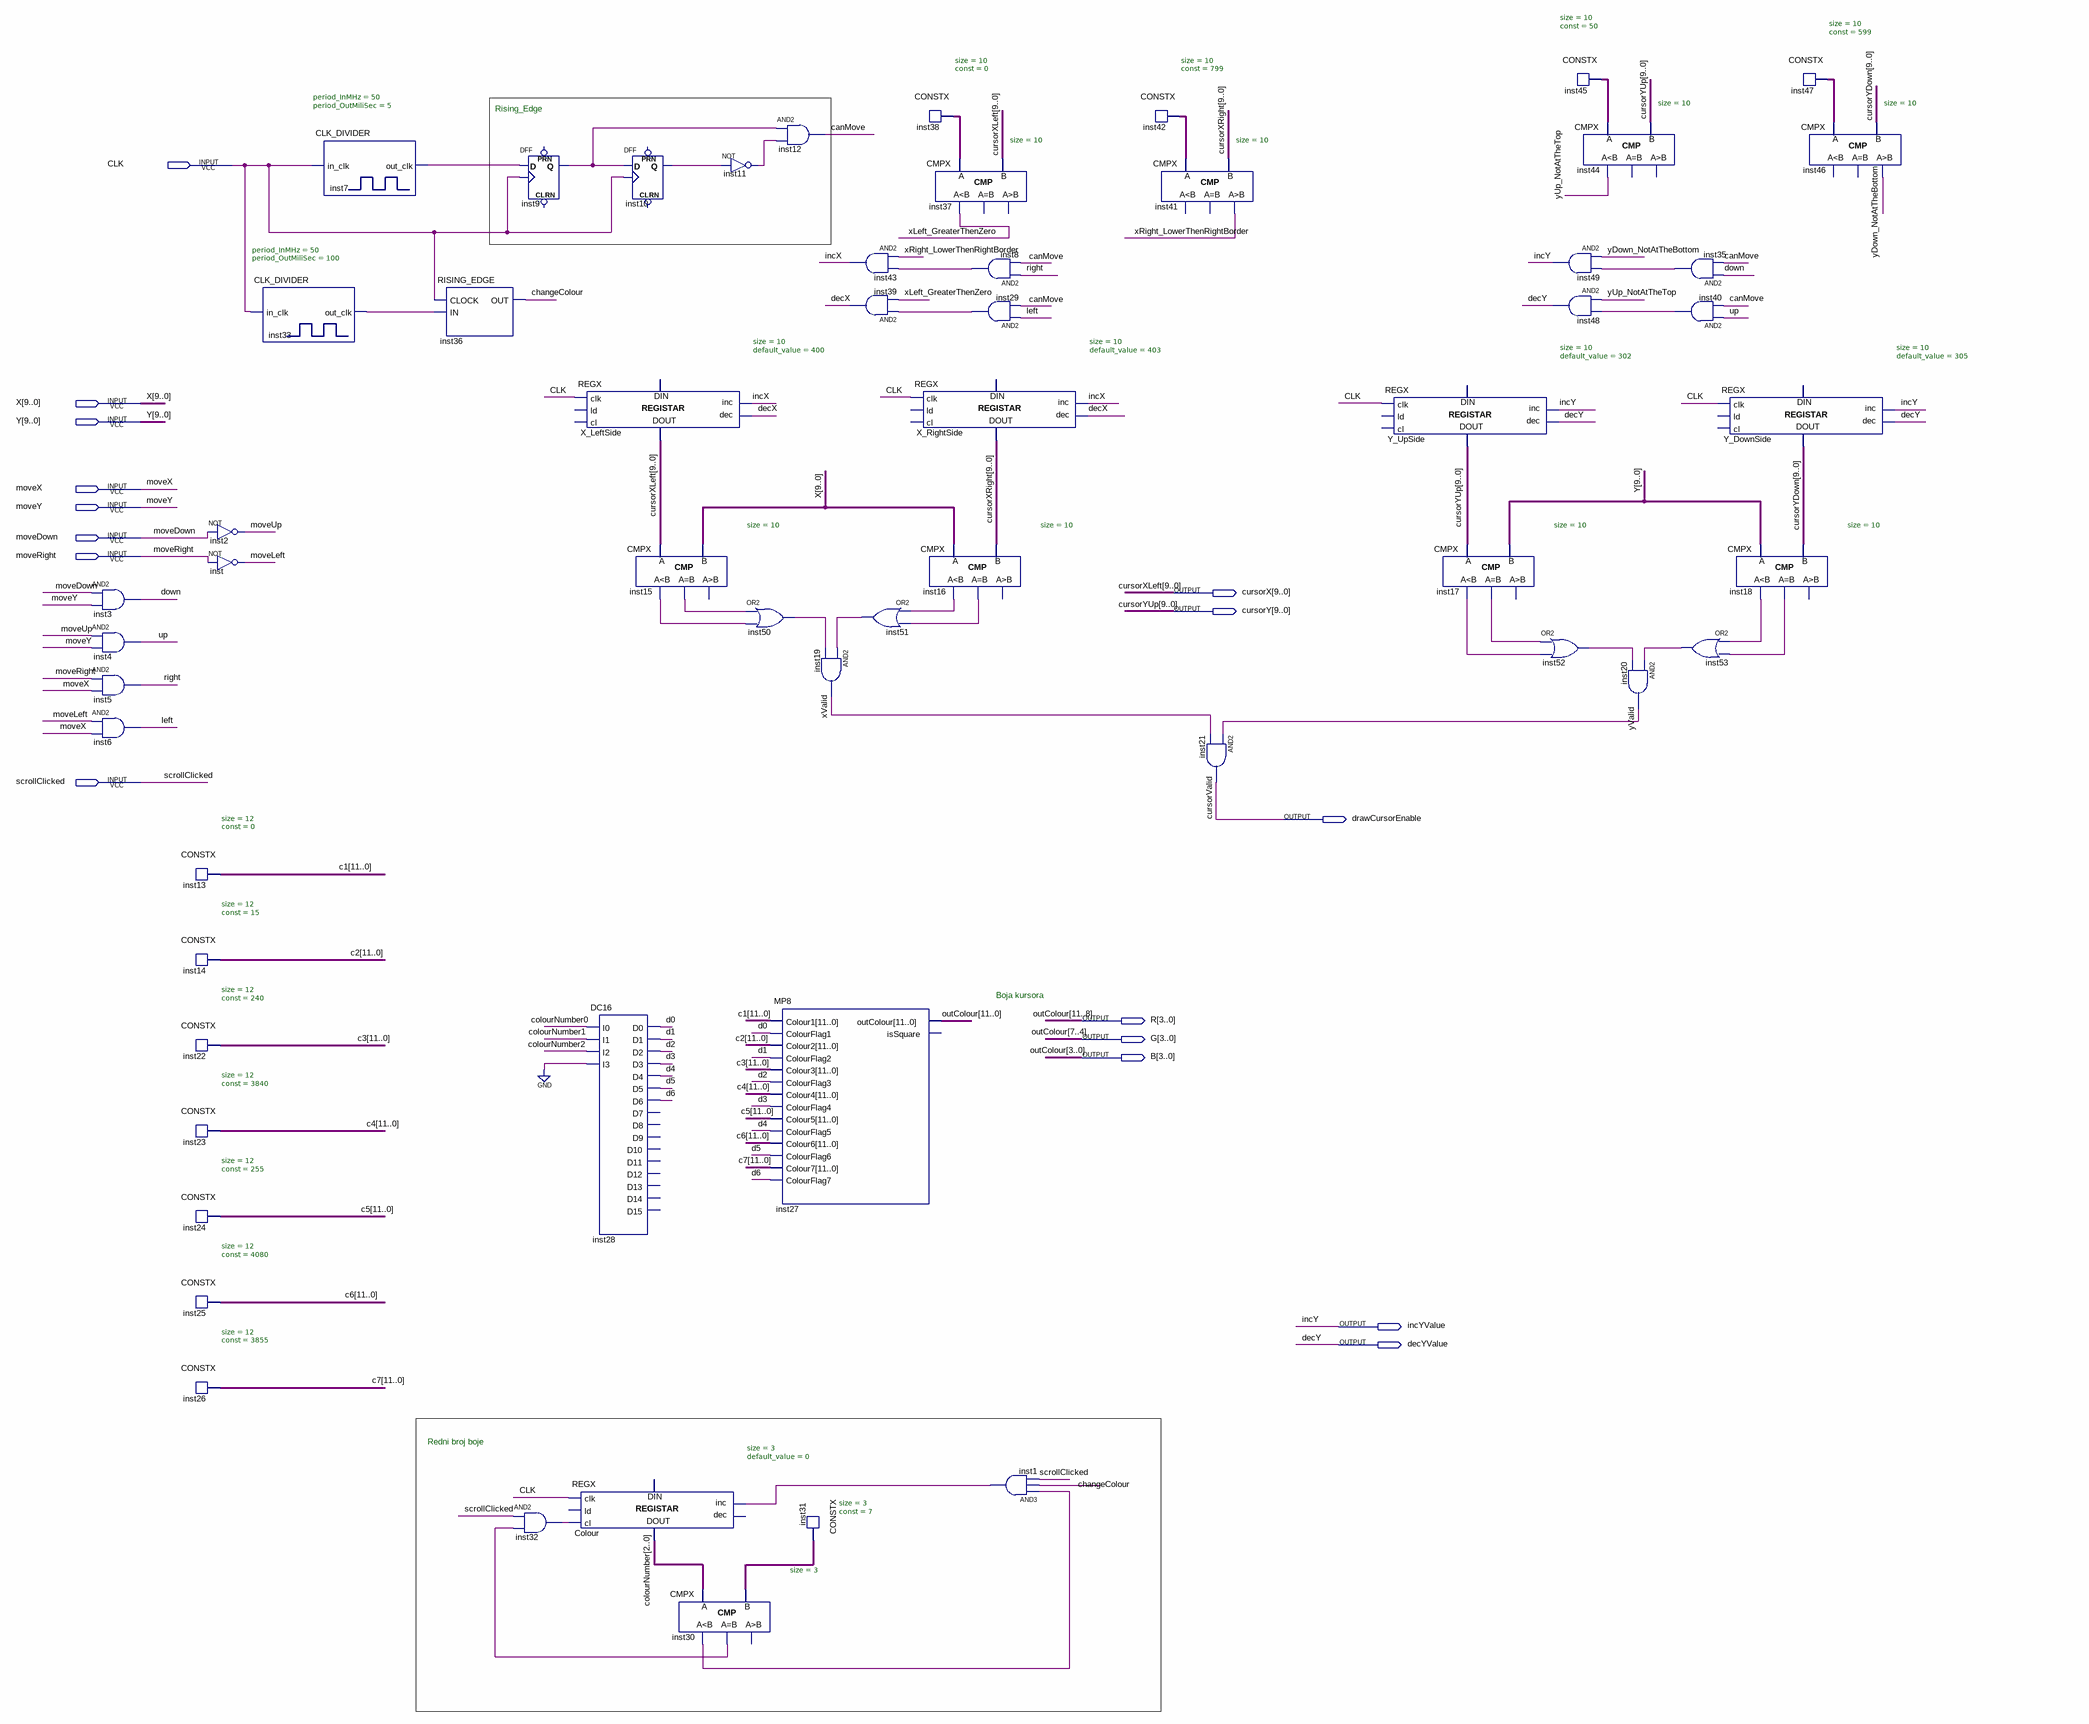
[diagram p0: schematic sheet]
// Quartus schematic Cursor.bdf as structural Verilog: 58 symbols, 16 pins
module Cursor (
  input  CLK,
  input  [9:0] X,
  input  [9:0] Y,
  input  moveX,
  input  moveY,
  input  moveDown,
  input  moveRight,
  input  scrollClicked,
  output [9:0] cursorX,
  output [9:0] cursorY,
  output drawCursorEnable,
  output [3:0] R,
  output [3:0] G,
  output [3:0] B,
  output incYValue,
  output decYValue
);

  wire canMove, changeColour, d0, d1, d2, d3, d4, d5, d6, decX, down, incX, inst1_out, inst7_out_clk,
       inst8_out, inst9_q, inst10_q, inst11_out, inst15_eq, inst15_ls, inst16_eq, inst16_ls, inst17_eq,
       inst17_ls, inst18_eq, inst18_ls, inst29_out, inst30_eq, inst30_ls, inst32_out, inst33_out_clk,
       inst35_out, inst40_out, inst50_out, inst51_out, inst52_out, inst53_out, left, moveLeft, moveUp, right,
       up, xLeft_GreaterThenZero, xRight_LowerThenRightBorder, xValid, yDown_NotAtTheBottom, yUp_NotAtTheTop,
       yValid;
  wire [2:0] colourNumber, inst31_data;
  wire [9:0] cursorXRight, cursorYDown, inst38_data, inst42_data, inst45_data, inst47_data;
  wire [11:0] c1, c2, c3, c4, c5, c6, c7;

  and inst3 (down, moveDown, moveY);
  and inst4 (up, moveUp, moveY);
  and inst5 (right, moveRight, moveX);
  and inst6 (left, moveLeft, moveX);
  CONSTX #(.size(12), .\const (0)) inst13 (.data(c1));
  CONSTX #(.size(12), .\const (15)) inst14 (.data(c2));
  CONSTX #(.size(12), .\const (240)) inst22 (.data(c3));
  CONSTX #(.size(12), .\const (3840)) inst23 (.data(c4));
  CONSTX #(.size(12), .\const (255)) inst24 (.data(c5));
  CONSTX #(.size(12), .\const (4080)) inst25 (.data(c6));
  CONSTX #(.size(12), .\const (3855)) inst26 (.data(c7));
  not inst2 (moveUp, moveDown);
  not inst (moveLeft, moveRight);
  CLK_DIVIDER #(.period_InMHz(50), .period_OutMiliSec(100)) inst33 (.in_clk(CLK), .out_clk(inst33_out_clk));
  CLK_DIVIDER #(.period_InMHz(50), .period_OutMiliSec(5)) inst7 (.in_clk(CLK), .out_clk(inst7_out_clk));
  RISING_EDGE inst36 (.CLOCK(CLK), .IN(inst33_out_clk), .OUT(changeColour));
  DFF inst9 (.CLK(CLK), .D(inst7_out_clk), .Q(inst9_q));  // open: CLRN, PRN
  and inst32 (inst32_out, scrollClicked, inst30_eq);
  REGX #(.size(10), .default_value(400)) X_LeftSide (
    .clk(CLK), .inc(incX), .dec(decX), .data_out(cursorX));  // open: ld, cl, data_in
  REGX #(.size(3), .default_value(0)) Colour (
    .clk(CLK), .cl(inst32_out), .inc(inst1_out), .data_out(colourNumber));  // open: ld, dec, data_in
  DFF inst10 (.CLK(CLK), .D(inst9_q), .Q(inst10_q));  // open: CLRN, PRN
  CMPX #(.size(10)) inst15 (.A(cursorX), .B(X), .ls(inst15_ls), .eq(inst15_eq));  // open: gr
  DC16 inst28 (
    .I0(colourNumber[0]), .I1(colourNumber[1]), .I2(colourNumber[2]), .I3(1'b0), .D0(d0), .D1(d1), .D2(d2),
    .D3(d3), .D4(d4), .D5(d5), .D6(d6));  // open: D7, D8, D9, D10, D11, D12, D13, D14, D15
  CMPX #(.size(3)) inst30 (.A(colourNumber), .B(inst31_data), .ls(inst30_ls), .eq(inst30_eq));  // open: gr
  not inst11 (inst11_out, inst10_q);
  or inst50 (inst50_out, inst15_eq, inst15_ls);
  MP8 inst27 (
    .Colour1(c1), .ColourFlag1(d0), .Colour2(c2), .ColourFlag2(d1), .Colour3(c3), .ColourFlag3(d2),
    .Colour4(c4), .ColourFlag4(d3), .Colour5(c5), .ColourFlag5(d4), .Colour6(c6), .ColourFlag6(d5),
    .Colour7(c7), .ColourFlag7(d6), .outColour({R, G, B}));  // open: isSquare
  and inst12 (canMove, inst9_q, inst11_out);
  and inst19 (xValid, inst51_out, inst50_out);
  CONSTX #(.size(3), .\const (7)) inst31 (.data(inst31_data));
  and inst43 (incX, xRight_LowerThenRightBorder, inst8_out);
  and inst39 (decX, inst29_out, xLeft_GreaterThenZero);
  or inst51 (inst51_out, inst16_ls, inst16_eq);
  CONSTX #(.size(10), .\const (0)) inst38 (.data(inst38_data));
  REGX #(.size(10), .default_value(403)) X_RightSide (
    .clk(CLK), .inc(incX), .dec(decX), .data_out(cursorXRight));  // open: ld, cl, data_in
  CMPX #(.size(10)) inst16 (.A(X), .B(cursorXRight), .ls(inst16_ls), .eq(inst16_eq));  // open: gr
  CMPX #(.size(10)) inst37 (.A(inst38_data), .B(cursorX), .ls(xLeft_GreaterThenZero));  // open: eq, gr
  and inst8 (inst8_out, right, canMove);
  and inst29 (inst29_out, left, canMove);
  and inst1 (inst1_out, inst30_ls, changeColour, scrollClicked);
  CONSTX #(.size(10), .\const (799)) inst42 (.data(inst42_data));
  CMPX #(.size(10)) inst41 (.A(inst42_data), .B(cursorXRight), .gr(xRight_LowerThenRightBorder));  // open: ls, eq
  and inst21 (drawCursorEnable, yValid, xValid);
  REGX #(.size(10), .default_value(302)) Y_UpSide (
    .clk(CLK), .inc(incYValue), .dec(decYValue), .data_out(cursorY));  // open: ld, cl, data_in
  CMPX #(.size(10)) inst17 (.A(cursorY), .B(Y), .ls(inst17_ls), .eq(inst17_eq));  // open: gr
  and inst49 (incYValue, yDown_NotAtTheBottom, inst35_out);
  and inst48 (decYValue, yUp_NotAtTheTop, inst40_out);
  or inst52 (inst52_out, inst17_eq, inst17_ls);
  CONSTX #(.size(10), .\const (50)) inst45 (.data(inst45_data));
  CMPX #(.size(10)) inst44 (.A(inst45_data), .B(cursorY), .ls(yUp_NotAtTheTop));  // open: eq, gr
  and inst20 (yValid, inst53_out, inst52_out);
  and inst35 (inst35_out, down, canMove);
  and inst40 (inst40_out, up, canMove);
  or inst53 (inst53_out, inst18_ls, inst18_eq);
  REGX #(.size(10), .default_value(305)) Y_DownSide (
    .clk(CLK), .inc(incYValue), .dec(decYValue), .data_out(cursorYDown));  // open: ld, cl, data_in
  CMPX #(.size(10)) inst18 (.A(Y), .B(cursorYDown), .ls(inst18_ls), .eq(inst18_eq));  // open: gr
  CONSTX #(.size(10), .\const (599)) inst47 (.data(inst47_data));
  CMPX #(.size(10)) inst46 (.A(inst47_data), .B(cursorYDown), .gr(yDown_NotAtTheBottom));  // open: ls, eq

  // Other names for the same wires on the sheet: cursorValid = drawCursorEnable; cursorXLeft[9:0] = cursorX;
  //   cursorYUp[9:0] = cursorY; decY = decYValue; incY = incYValue; outColour[11:0] = {R, G, B}

  // Notes on the sheet:
  //   Rising_Edge
  //   Boja kursora
  //   Redni broj boje
endmodule
